# Altium project S4V_Motor_Driver_Board_V1.0.PrjPcb
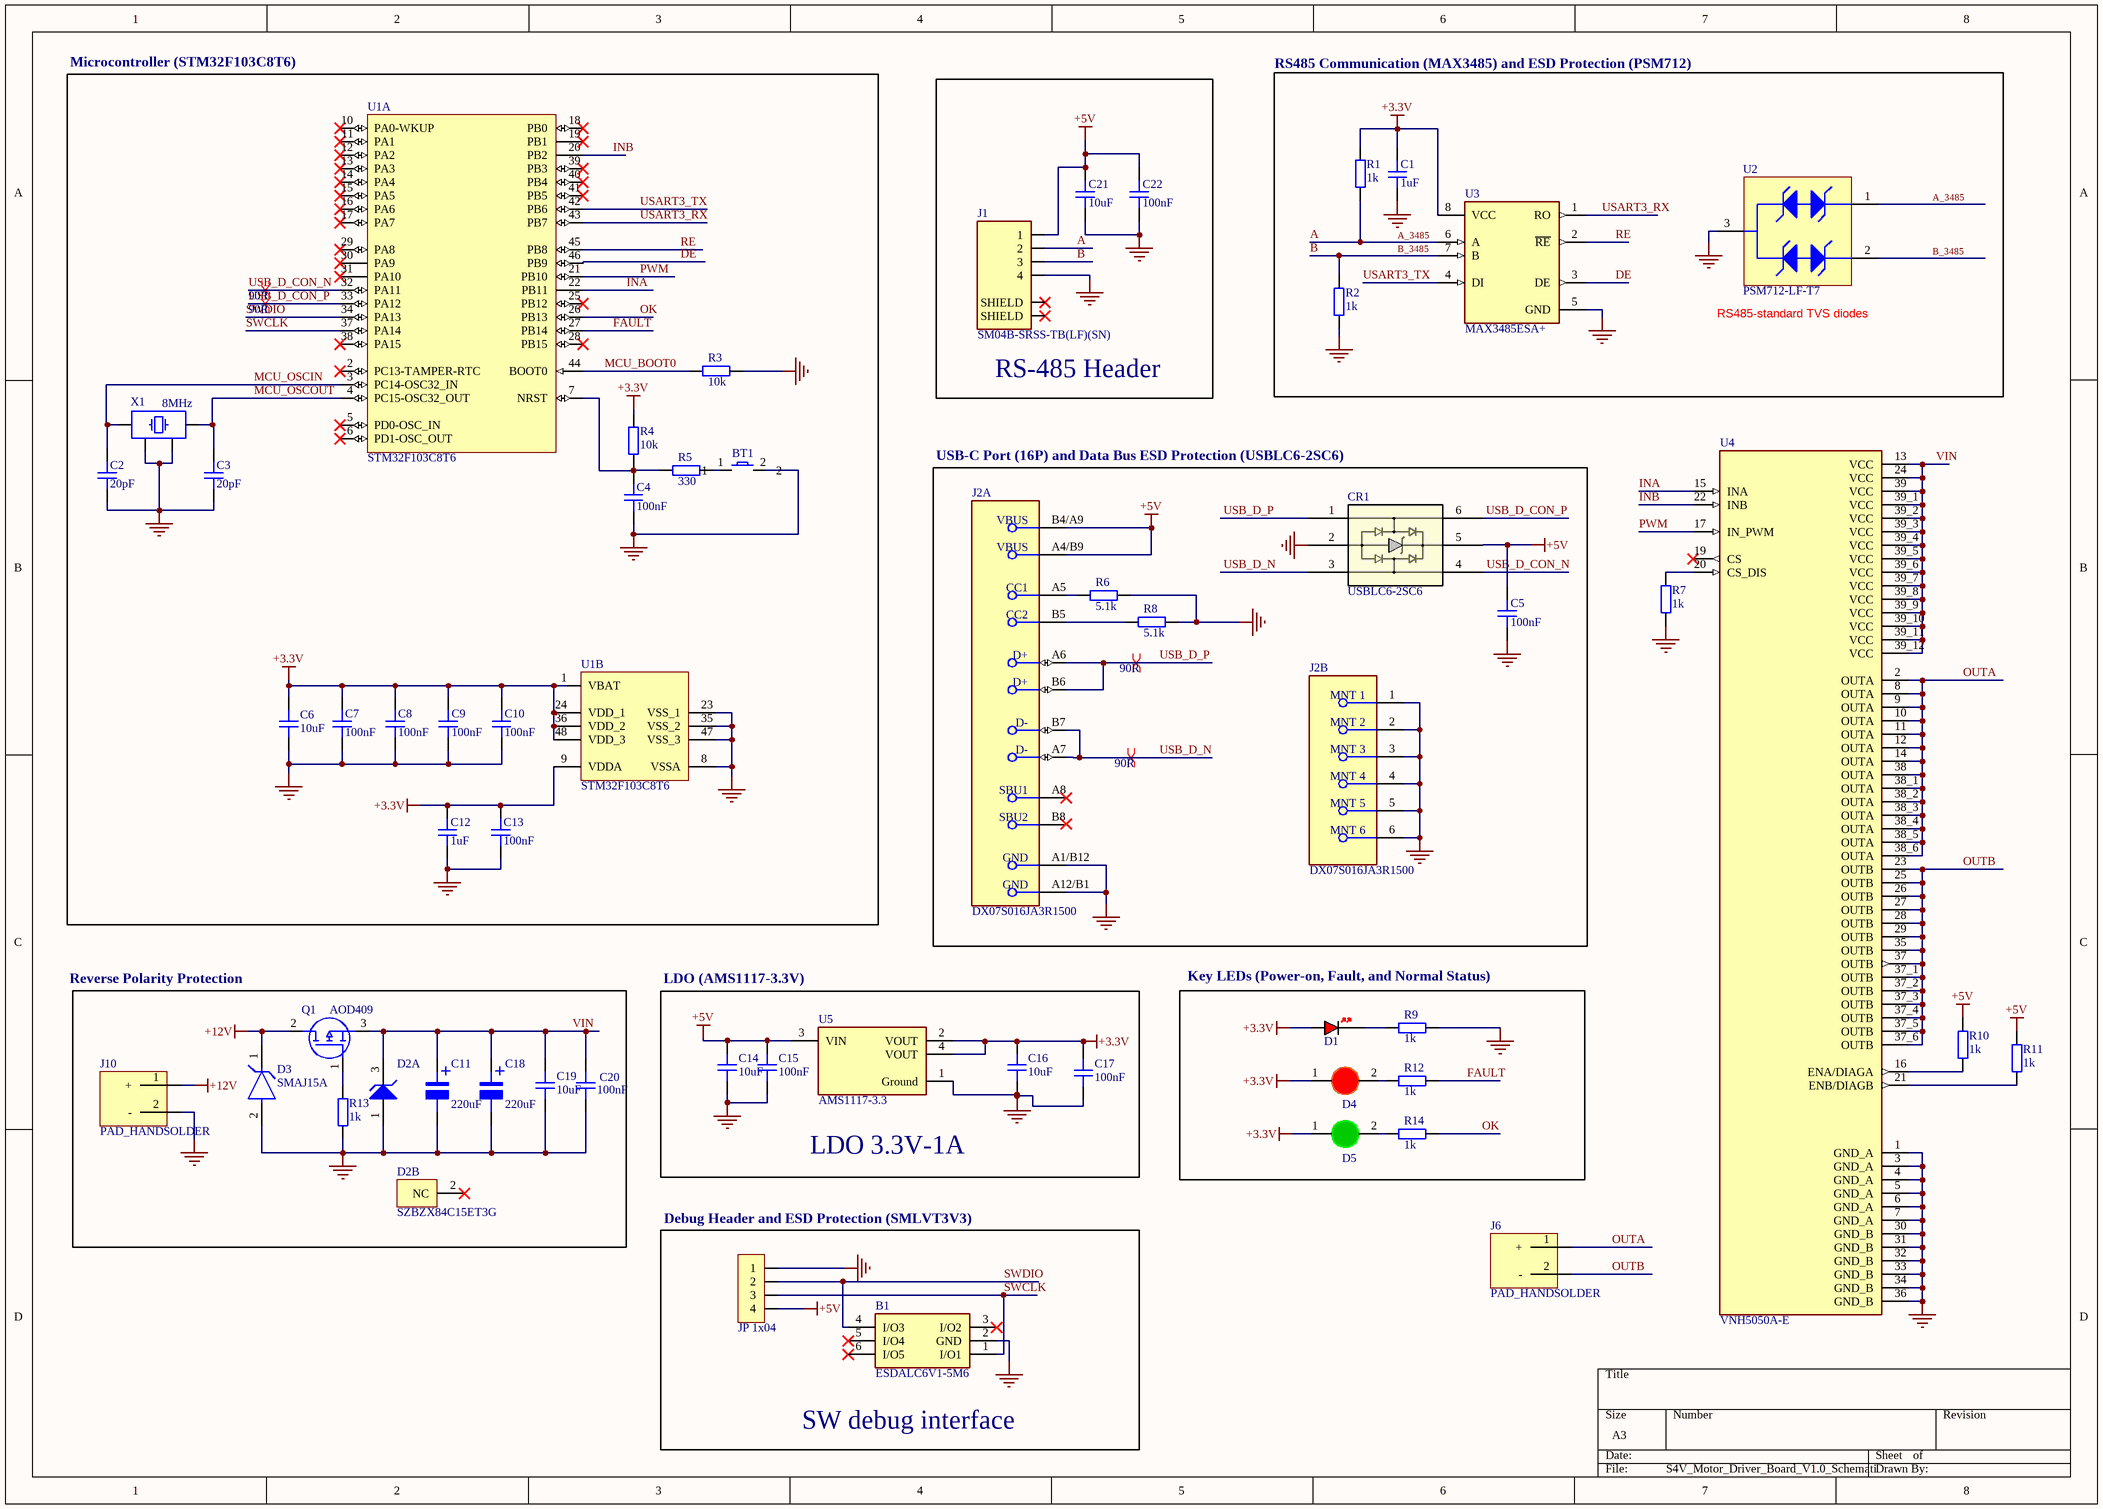
[diagram p0: S4V_Motor_Driver_Board_V1.0_Schematic.SchDoc]
1 sheet, 56 parts. Net scope: global (net labels, ports and power ports of the same name join across sheets).
Board file: S4V_Motor_Driver_Board_V1.0_PCB.PcbDoc

## Sheet S4V_Motor_Driver_Board_V1.0_Schematic.SchDoc
size A3; SheetNumber: 1; SheetTotal: 1

### Parts
B1  ESDALC6V1-5M6  [ESDALC6V15M6]
BT1  Button_3x4mm_SMD  [Button_3x4mm_SMD]  (value not drawn)
C1  1uF  [CAP_0603]
C2  20pF  [CAP_0603]
C3  20pF  [CAP_0603]
C4  100nF  [CAP_0603]
C5  100nF  [CAP_0603]
C6  10uF  [CAP_0603]
C7  100nF  [CAP_0603]
C8  100nF  [CAP_0603]
C9  100nF  [CAP_0603]
C10  100nF  [CAP_0603]
C11  220uF  [tu nhom 8 (f)]
C12  1uF  [CAP_0603]
C13  100nF  [CAP_0603]
C14  10uF  [CAP_0805]
C15  100nF  [CAP_0805]
C16  10uF  [CAP_0805]
C17  100nF  [CAP_0805]
C18  220uF  [tu nhom 8 (f)]
C19  10uF  [CAP_0805]
C20  100nF  [CAP_0805]
C21  10uF  [CAP_0603]
C22  100nF  [CAP_0603]
CR1  USBLC6-2SC6  [SOT23-6L_STM]
D1  RED  [LED_0603_RED]  (value not drawn)
D2  SZBZX84C15ET3G  [ONSC-SOT-23-3-318-08_V]  (value not drawn)  (parts A,B of 2)
D3  SMAJ15A  [FP-SMA-MFG]
D4  LED 3mm  [LED-3MM-RED]  (value not drawn)
D5  LED 3mm  [LED-3MM-GREEN]  (value not drawn)
J1  SM04B-SRSS-TB(LF)(SN)  [JST_SM04B-SRSS-TB(LF)(SN)]
J2  DX07S016JA3R1500  [FP-DX07S016JA3R1500-MFG]  (parts A,B of 2)
J6  PAD_HANDSOLDER  [PCBComponent_1]
J10  PAD_HANDSOLDER  [PCBComponent_1]
JP1  JP 1x04  [JP 1x4 DT]
Q1  AOD409  [AOD409]
R1  1k  [RES_0603]
R2  1k  [RES_0603]
R3  10k  [RES_0603]
R4  10k  [RES_0603]
R5  330  [RES_0603]
R6  5.1k  [RES_0603]
R7  1k  [RES_0402]
R8  5.1k  [RES_0603]
R9  1k  [RES_0603]
R10  1k  [RES_0402]
R11  1k  [RES_0402]
R12  1k  [RES_0603]
R13  1k  [RES_0603]
R14  1k  [RES_0603]
U1  STM32F103C8T6  [STM-LQFP48_L]  (parts A,B of 2)
U2  PSM712-LF-T7  [PRKT-SOT23-3_V]
U3  MAX3485ESA+  [FP-S8-5-MFG]
U4  VNH5050A-E  [SOP50P1030X247-39N]
U5  AMS1117-3.3  [FP-AMS1117-IPC_C]
X1  8MHz  [XTAL_3225]

### Blocks framed on the sheet
Microcontroller (STM32F103C8T6): BT1 C2-C4 C6-C10 C12 C13 R3-R5 U1 X1
RS-485 Header: C21 C22 J1
RS485 Communication (MAX3485) and ESD Protection (PSM712): C1 R1 R2 U2 U3
USB-C Port (16P) and Data Bus ESD Protection (USBLC6-2SC6): C5 CR1 J2 R6 R8
Key LEDs (Power-on, Fault, and Normal Status): D1 D4 D5 R9 R12 R14
LDO 3.3V-1A: C14-C17 U5
SW debug interface: B1 JP1

### Nets
+3.3V: C1.2 C6.2 C7.2 C8.2 C9.2 C10.2 C12.2 C13.2 C16.2 C17.2 D1.A D4.1(A) D5.1(A) R1.1 R4.2 U1.1(VBAT) U1.9(VDDA) U1.24(VDD_1) U1.36(VDD_2) U1.48(VDD_3) U3.8(VCC) U5.2(VOUT) U5.4(VOUT)
+5V: C5.2 C14.2 C15.2 C21.2 C22.2 CR1.5 J1.1 J2.A4/B9(VBUS) J2.B4/A9(VBUS) JP1.4 R10.2 R11.2 U5.3(VIN)
+12V: D3.1(C) J10.1(+) Q1.2(D)
GND: B1.2(GND) BT1.2 C1.1 C2.1 C3.1 C4.1 C5.1 C6.1 C7.1 C8.1 C9.1 C10.1 C11.2 C12.1 C13.1 C14.1 C15.1 C16.1 C17.1 C18.2 C19.1 C20.1 C21.1 C22.1 CR1.2 D2.1(A) D3.2(A) J1.4 J2.1(MNT_1) J2.2(MNT_2) J2.3(MNT_3) J2.4(MNT_4) J2.5(MNT_5) J2.6(MNT_6) J2.A1/B12(GND) J2.A12/B1(GND) J10.2(-) JP1.1 R2.1 R3.2 R6.2 R7.1 R8.2 R9.2 R13.1 U1.8(VSSA) U1.23(VSS_1) U1.35(VSS_2) U1.47(VSS_3) U2.3 U3.5(GND) U4.1(GND_A) U4.3(GND_A) U4.4(GND_A) U4.5(GND_A) U4.6(GND_A) U4.7(GND_A) U4.30(GND_B) U4.31(GND_B) U4.32(GND_B) U4.33(GND_B) U4.34(GND_B) U4.36(GND_B) U5.1(Ground) X1.2 X1.4
A: J1.2 R1.2 U2.1 U3.6(A)  [also labelled A_3485]
B: J1.3 R2.2 U2.2 U3.7(B)  [also labelled B_3485]
DE: U1.46(PB9) U3.3(DE)
FAULT: R12.2 U1.27(PB14)
INA: U1.22(PB11) U4.15(INA)
INB: U1.20(PB2) U4.22(INB)
MCU_BOOT0: R3.1 U1.44(BOOT0)
MCU_OSCIN: C2.2 U1.3(PC14-OSC32_IN) X1.1
MCU_OSCOUT: C3.2 U1.4(PC15-OSC32_OUT) X1.3
OK: R14.2 U1.26(PB13)
OUTA: J6.1(+) U4.2(OUTA) U4.8(OUTA) U4.9(OUTA) U4.10(OUTA) U4.11(OUTA) U4.12(OUTA) U4.14(OUTA) U4.38(OUTA) U4.38_1(OUTA) U4.38_2(OUTA) U4.38_3(OUTA) U4.38_4(OUTA) U4.38_5(OUTA) U4.38_6(OUTA)
OUTB: J6.2(-) U4.23(OUTB) U4.25(OUTB) U4.26(OUTB) U4.27(OUTB) U4.28(OUTB) U4.29(OUTB) U4.35(OUTB) U4.37(OUTB) U4.37_1(OUTB) U4.37_2(OUTB) U4.37_3(OUTB) U4.37_4(OUTB) U4.37_5(OUTB) U4.37_6(OUTB)
PWM: U1.21(PB10) U4.17(IN_PWM)
RE: U1.45(PB8) U3.2(~{RE})
SWCLK: B1.1(I/O1) JP1.3 U1.37(PA14)
SWDIO: B1.4(I/O3) JP1.2 U1.34(PA13)
USART3_RX: U1.43(PB7) U3.1(RO)
USART3_TX: U1.42(PB6) U3.4(DI)
USB_D_CON_N: CR1.4 U1.32(PA11)
USB_D_CON_P: CR1.6 U1.33(PA12)
USB_D_N: CR1.3 J2.A7(D-) J2.B7(D-)
USB_D_P: CR1.1 J2.A6(D+) J2.B6(D+)
VIN: C11.1 C18.1 C19.2 C20.2 D2.3(K) Q1.3(S) U4.13(VCC) U4.24(VCC) U4.39(VCC) U4.39_1(VCC) U4.39_2(VCC) U4.39_3(VCC) U4.39_4(VCC) U4.39_5(VCC) U4.39_6(VCC) U4.39_7(VCC) U4.39_8(VCC) U4.39_9(VCC) U4.39_10(VCC) U4.39_11(VCC) U4.39_12(VCC)
NetBT1_1: BT1.1 R5.2
NetC4_2: C4.2 R4.1 R5.1 U1.7(NRST)
NetD1_K: D1.K R9.1
NetD4_2: D4.2(K) R12.1
NetD5_2: D5.2(K) R14.1
NetJ2_A5: J2.A5(CC1) R6.1
NetJ2_B5: J2.B5(CC2) R8.1
NetQ1_1: Q1.1(G) R13.2
NetR7_2: R7.2 U4.20(CS_DIS)
NetR10_1: R10.1 U4.16(ENA/DIAGA)
NetR11_1: R11.1 U4.21(ENB/DIAGB)

Not connected (* = marked no-connect by the designer): B1 3(I/O2)* 5(I/O4)* 6(I/O5)*; D2 2(NC)*; J1 S1(SHIELD)* S2(SHIELD)*; J2 A8(SBU1)* B8(SBU2); U1 2(PC13-TAMPER-RTC)* 5(PD0-OSC_IN)* 6(PD1-OSC_OUT)* 10(PA0-WKUP)* 11(PA1)* 12(PA2)* 13(PA3)* 14(PA4)* 15(PA5)* 16(PA6)* 17(PA7)* 18(PB0)* 19(PB1)* 25(PB12)* 28(PB15)* 29(PA8)* 30(PA9)* 31(PA10)* 38(PA15)* 39(PB3)* 40(PB4)* 41(PB5)*; U4 19(CS)*

### Layout directives
differential pair; differential pair class 90R: USB_D_CON_N, USB_D_CON_P, USB_D_N, USB_D_P

### Notes on the sheet
- (near U2) RS485-standard TVS diodes
- Reverse Polarity Protection
- LDO (AMS1117-3.3V)
- (near JP1) Debug Header and ESD Protection (SMLVT3V3)
- (in symbol Tu Nhom 220uF 25V) +

### Library data of the parts
B1 = ESDALC6V1-5M6: STMicroelectronics ESDALC6V1-5M6 Quint Uni-Directional TVS Diode, 30W peak, 6-Pin uQFN; Geometry.Height: 0.65mm; Manufacturer_Name: STMicroelectronics; Manufacturer_Part_Number: ESDALC6V1-5M6; Mouser Part Number: 511-ESDALC6V1-5M6; Mouser Price/Stock: https://www.mouser.co.uk/ProductDetail/STMicroelectronics/ESDALC6V1-5M6?qs=riAxU6JNBCsF7CaldDOuJw%3D%3D; Arrow Part Number: ESDALC6V1-5M6; Arrow Price/Stock: https://www.arrow.com/en/products/esdalc6v1-5m6/stmicroelectronics?utm_currency=USD&region=nac; Datasheet Link: https://www.st.com/resource/en/datasheet/esdalc6v1-5m6.pdf
BT1 = Button_3x4mm_SMD: Button SMD 3x4mm 2 Pins
C1-C10 C12 C13 C21 C22 = CAP_0603: Capacitor SMD 0603; Manufacturer: *; Manufacturer Part Number: *; Distributor Link: *; LCSC: *; Rating: *; Dielectric: *
C11 C18 = Tu Nhom 220uF 25V: Dán; Don_Vi: Con; So_Chan: 2; Ten_Linh_Kien: Tụ Nhôm 220uF 25V; Ma_Hang: MH002221; Chung_Loai: Dán; Kieu_Chan: *
C14-C17 C19 C20 = CAP_0805: Capacitor SMD 0805; Manufacturer: *; Manufacturer Part Number: *; Distributor Link: *; LCSC: *; Rating: *; Dielectric: *
CR1 = USBLC6-2SC6: ESD Protection for USB 2.0 High Speed; Manufacturer_Name: STMicroelectronics; Copyright: Copyright (C) 2025 Ultra Librarian. All rights reserved.; Manufacturer_Part_Number: USBLC6-2SC6; RefDes: RefDes; Type: Type
D1 = LED_0603_RED: LED 0603 RED SMD
D2 = CMP-1060-00853-1: Zener Voltage Regulator, 225 mW, 3-Pin SOT-23, Pb-Free, Tape and Reel; Manufacturer: On Semiconductor; DatasheetVersion: Rev. 8; ComponentLink2Description: Datasheet; PartNumber: SZBZX84C15ET3G; ComponentLink1URL: http://www.onsemi.com/; ComponentLink2URL: http://www.onsemi.com/pub_link/Collateral/BZX84C2V4ET1-D.PDF; ComponentLink1Description: Manufacturer URL; PackageDescription: 3-Pin Small Outline Transistor, Body 2.92 x 1.3 mm, Pitch 0.95 mm; Mounting Technology: Surface Mount; RoHS: Pb-Free; PackageVersion: Rev. AP, 11/2009; PackageReference: SOT-23-3-318-08; ComponentLink3Description: Package Specification; Packing: Tape and Reel; ComponentLink3URL: http://www.onsemi.cn/pub_link/Collateral/318-08.PDF
D3 = CMP-07401-000026-1: TVS DIODE 15V 24.4V SMA; Manufacturer: Bourns Inc.; Description: 24.4V Clamp 16.4A Ipp Tvs Diode Surface Mount SMA (DO-214AC); Max Junction Temp: +150°C; Peak Pulse Current: 16.4A; Direction: Unidirectional; Breakdown Voltage: 16.7V; Number Of Channels: 1; Peak Pulse Power: 400W; Mouser Description: Bourns Smaj15a / Diode Tvs 15v 400w Uni 5% Smd Bourns; Temperature Range Low: -55°C; ComponentLink2Description: Datasheet; Package: SMA; Reverse Standoff Voltage: 15V; Category: Diode; Device Class L2: TVS Diodes; Lead Free: Yes; RoHS: TRUE; Clamping Voltage: 24.4V; ComponentLink2URL: https://www.bourns.com/docs/Product-Datasheets/SMAJ.pdf; Digikey Description: TVS DIODE 15V 24.4V SMA; Temperature Range High: +150°C; Height: 2.29mm; Device Class L1: Circuit Protection; Device Class L3: unset; Temperature: -55°C to +150°C; Octopart: https://octopart.com/smaj15a-bourns-12809353; Manufacturer Part Number: SMAJ15A; Automotive: No
D4 = LED 3mm Do: Cắm; Don_Vi: Con; Ma_Hang: MH003892; Ten_Linh_Kien: Led 3MM Phủ Đỏ (10c); Ghi_Chu: *; Kieu_Chan: *; Chung_Loai: Cắm
D5 = LED 3mm Xanh La: Cắm; Don_Vi: Con; Ma_Hang: MH001054; Ten_Linh_Kien: Led 3MM Phủ Xanh (10c); Ghi_Chu: *; Kieu_Chan: *; Chung_Loai: Cắm
J1 = SM04B-SRSS-TB(LF)(SN): Connector Header Surface Mount, Right Angle 4 position 0.039 (1.00mm); MF: JST Sales; SnapEDA_Link: https://www.snapeda.com/parts/SM04B-SRSS-TB(LF)(SN)/JST/view-part/?ref=snap; Package: None; Value: *; MP: SM04B-SRSS-TB(LF)(SN); Check_prices: https://www.snapeda.com/parts/SM04B-SRSS-TB(LF)(SN)/JST/view-part/?ref=eda
J2 = CMP-19038-000002-1: CONN RCP USB2.0 TYP C 24P SMD RA
J6 J10 = PAD_HANDSOLDER: HandSolder Pad for PWR IN
JP1 = JP 1x4 2.54 Duc Thang: Cắm; Ten_Linh_Kien: Jump Đơn Đực 2.54MM 1x40P Thẳng 11MM; Don_Vi: Con; Ma_Hang: MH000903; Ghi_Chu: *; Kieu_Chan: *; Chung_Loai: Cắm
Q1 = AOD409: 60V P-Channel MOSFET; Manufacturer_Name: Alpha & Omega Semiconductors; Geometry.Height: 2.4mm; Manufacturer_Part_Number: AOD409; Mouser Part Number: *; Mouser Price/Stock: *; Arrow Part Number: AOD409; Arrow Price/Stock: https://www.arrow.com/en/products/aod409/alpha-and-omega-semiconductor?region=nac; Datasheet Link: http://www.aosmd.com/res/data_sheets/AOD409.pdf
R1-R6 R8 R9 R12-R14 = RES_0603: Resistor SMD 0603; Manufacturer: *; Manufacturer Part Number: *; Distributor Link: *; LCSC: *
R7 R10 R11 = RES_0402: Resistor SMD 0402; Manufacturer: *; Manufacturer Part Number: *; Distributor Link: *; LCSC: *
U1 = CMP-0237-00215-3: ARM Cortex-M3 32-bit MCU, 64 KB Flash, 20 KB Internal RAM, 37 I/Os, 48-pin LQFP, -40 to 85 degC, Tray; Supply Voltage(Vcc) min (V): 2; Internal RAM Size (kB): 20; FLASH Size (Prog) (kB): 64; A/D Converter: 2x12-bit (10 Channel); I/Os (High Current): 37; Operating Frequency(F) (Processor speed) (MHz): 72; Core: ARM Cortex-M3; ComponentLink3Description: Package Specification; Mounting Technology: Surface Mount; PartNumber: STM32F103C8T6; PackageReference: LQFP48; Packing: Tray; ComponentLink3URL: http://www.st.com/st-web-ui/static/active/en/resource/technical/document/datasheet/DM00058181.pdf; DatasheetVersion: Rev. 16; ComponentLink1URL: http://www.st.com/web/en/home.html; PackageVersion: Rev. 6, 06/2013; ComponentLink2URL: http://www.st.com/st-web-ui/static/active/en/resource/technical/document/datasheet/CD00161566.pdf; ComponentLink1Description: Manufacturer URL; ComponentLink2Description: Datasheet; PackageDescription: 48-Pin Low Profile Quad Flat Package, 7 x 7 mm Body, 0.5 mm Pitch
U2 = CMP-2000-07553-1: TVS Array - Asymmetrical Data Line Protector, 600 W, 7.5 V, -55 to 150 degC, 3-Pin SOT23, RoHS, Tape and Reel; Manufacturer: Protek Devices; Min Breakdown Voltage: 7.5V; Direction: Bidirectional; Capacitance: 75pF; Current: 20uA; Power Dissipation: 600W; Working Voltage: 7V; Voltage: 12V; Case\/Package: SOT-23; Clamping Voltage: 17V; Element Configuration: Dual; Mounting Technology: SurfaceMount; RoHSCompliant: True; Radiation Hardening: No; Depth: 1.4mm; Lead Free: LeadFree; Package Description: 3-Pin Small Outline Transistor, Body 2.92 x 1.3 mm, Pitch 0.94 mm; Max Operating Temperature: 150degC; Length: 3.04mm; Manufacturer URL: http://www.protekdevices.com/; Min Operating Temperature: -55degC; Leakage Current: 20uA; Datasheet URL: www.protekdevices.com/xyz/documents/datasheets/psm712.pdf; Packaging: TapeandReel; Datasheet Version: 10/2013; Package Reference: SOT23-3; Number of Pins: 3
U3 = CMP-05679-000038-1: IC TXRX RS485/422 10MBPS 8SOIC; Manufacturer Part Number: MAX3485EESA+; Manufacturer: Maxim Integrated; Number Of Receivers: 1; Simplex Duplex: Half Duplex; Data Rate: 15Mbits/s; Interface: RS-485,RS-422; Max Supply Voltage: 3.6V; Nominal Supply Current: 0.95-1.1mA; Min Supply Voltage: 3V; Standoff Height: 0.1mm; Mouser Description: RS-422/RS-485 Interface IC 3.3V 12Mbps Transceiver; Lead Free: Yes; Footprint Url: https://pdfserv.maximintegrated.com/land_patterns/90-0096.PDF; Device Class L1: Integrated Circuits (ICs); Device Class L3: RS-232 / RS-422 / RS-485 Interface ICs; RoHS: TRUE; Height: 1.75mm; ComponentLink2URL: https://datasheets.maximintegrated.com/en/ds/MAX3483E-MAX3491E.pdf; Temperature Range High: +85°C; Temperature: -40°C to +85°C; Number Of Transmitters: 1; Device Class L2: Interface ICs; Octopart: https://octopart.com/max3485eesa%2B-maxim+integrated-39731903; ComponentLink2Description: Datasheet; Category: IC; Digikey Description: IC TXRX RS485/422 10MBPS 8SOIC; Automotive: No; Temperature Range Low: -40°C; Package: S8-5
U4 = VNH5050A-E: - Motor Driver Power MOSFET Parallel, PWM PowerSSO-36 TP; MF: STMicroelectronics; SnapEDA_Link: https://www.snapeda.com/parts/VNH5050A-E/STMicroelectronics/view-part/?ref=snap; Package: BFSOP-36 STMicroelectronics; Value: *; MP: VNH5050A-E; Check_prices: https://www.snapeda.com/parts/VNH5050A-E/STMicroelectronics/view-part/?ref=eda
U5 = CMP-209535-000001-1: LDO Voltage Regulators 1A, 3.3V; Manufacturer: Advanced Monolithic Systems; Dropout Voltage: 1.1V; Output Type: Fixed; Nominal Supply Current: 5mA; Max Power Dissipation: 1.2W; Max Supply Voltage: 15V; Number Of Outputs: 1; Standoff Height: 0.64mm; Max Junction Temp: +125°C; Height: 1.8mm; Package: AMS1117; Device Class L2: Power Management ICs; ComponentLink2Description: Datasheet; ComponentLink2URL: http://www.advanced-monolithic.com/pdf/ds1117.pdf; Category: IC; RoHS: TRUE; Automotive: No; Device Class L1: Integrated Circuits (ICs); Output Current: 1A; Device Class L3: Voltage Regulators - Linear; Temperature: -40°C to +125°C; Output Voltage: 3.3V; Manufacturer Part Number: AMS1117-3.3; Temperature Range Low: -40°C; Octopart: https://octopart.com/ams1117-3.3-advanced+monolithic+systems-25899300; Lead Free: Yes; Ipc Land Pattern Name: SOT229P700X180-4; Temperature Range High: +125°C
X1 = TSX-3225_24.0000MF15X-AC: Crystal SMD 24MHz 10PPM 7pF 3225; Manufacturer: Epson; Manufacturer Part Number: TSX-3225 24.0000MF15X-AC